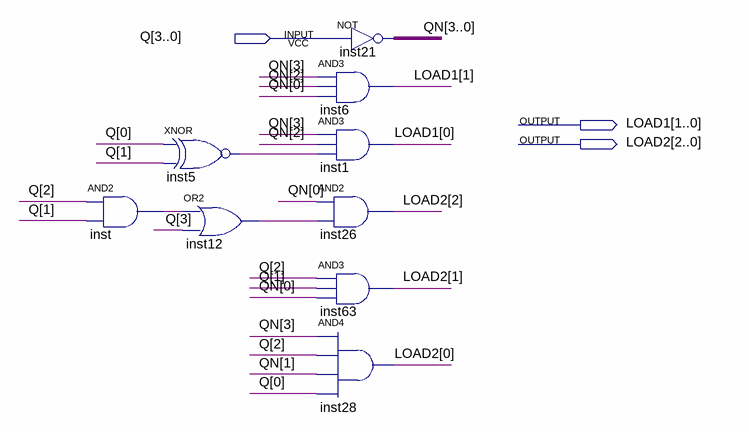
[diagram p0: schematic sheet]
// Quartus schematic LOAD.bdf as structural Verilog: 9 symbols, 3 pins
module LOAD (
  input  [3:0] Q,
  output [1:0] LOAD1,
  output [2:0] LOAD2
);

  wire inst5_out, inst12_out, inst_out;
  wire [3:0] QN;

  and inst (inst_out, Q[2], Q[1]);
  xnor inst5 (inst5_out, Q[0], Q[1]);
  or inst12 (inst12_out, inst_out, Q[3]);
  and inst6 (LOAD1[1], QN[3], QN[2], QN[0]);
  and inst1 (LOAD1[0], QN[3], QN[2], inst5_out);
  and inst26 (LOAD2[2], QN[0], inst12_out);
  and inst63 (LOAD2[1], Q[2], Q[1], QN[0]);
  and inst28 (LOAD2[0], QN[3], Q[2], QN[1], Q[0]);
  assign QN = ~Q;  // NOT inst21, 4 bits wide
endmodule
